# Altium schematic sheet [2]STM32F334R8T6Board_Interfaces.SchDoc
size B
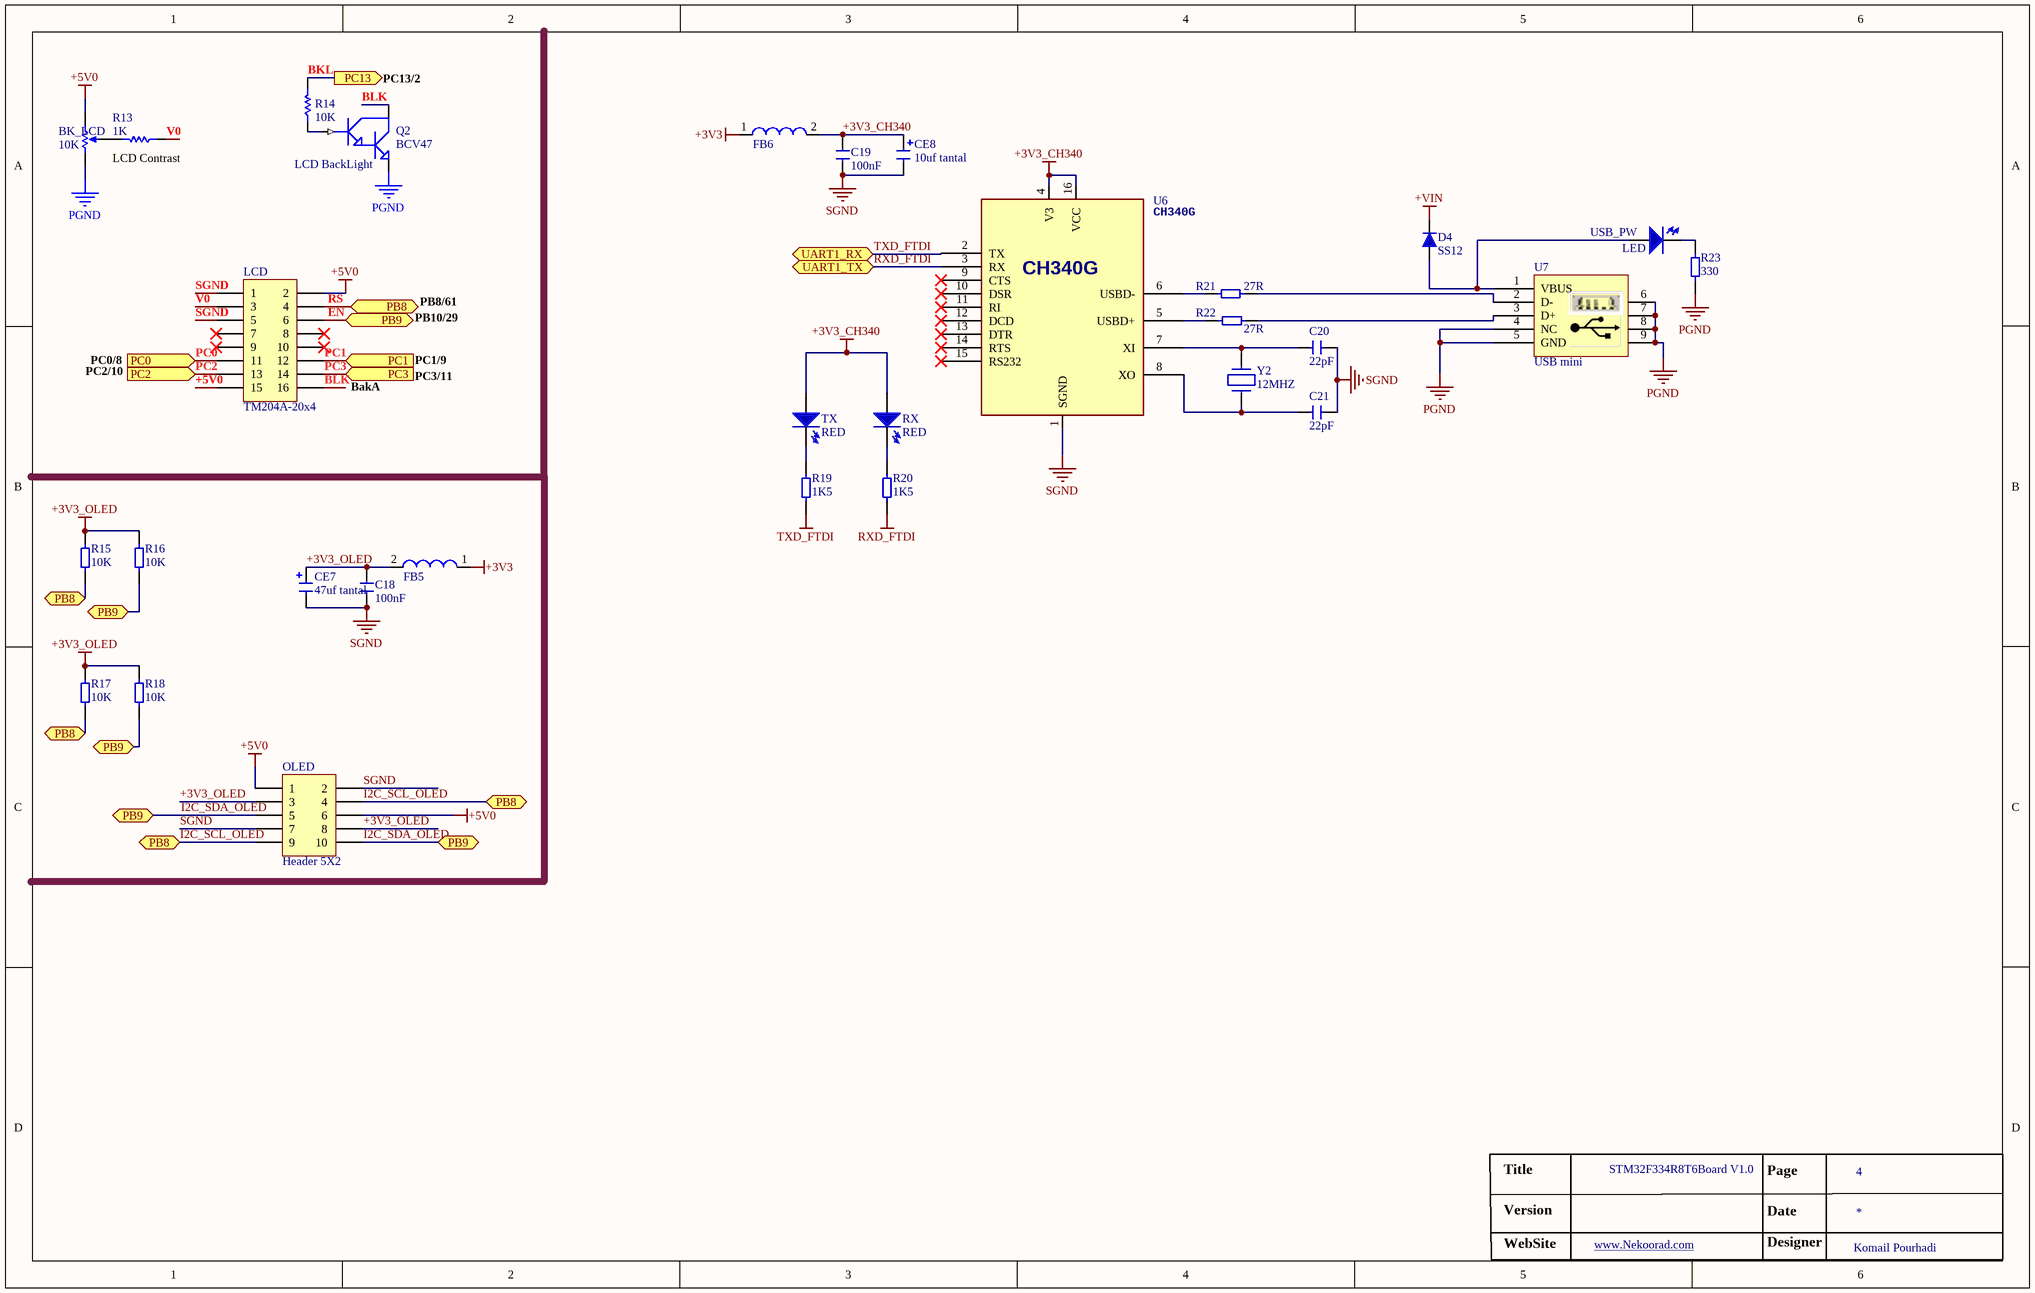
[diagram p0: [2]STM32F334R8T6Board_Interfaces.SchDoc]

## Parts
BK_LCD  value 10K  [JFP]  (hidden comment: RPot)
C18  Comment  [SMD_CAP_1206]  (value not drawn)
C19  Comment  [SMD_CAP_1206]  (value not drawn)
C20  Comment  [SMD_CAP_1206]  (value not drawn)
C21  Comment  [SMD_CAP_1206]  (value not drawn)
CE7  47uf tantal  [CAP-E-3]
CE8  10uf tantal  [cap-e-2]
D4  SS12  [Diode SMA-M]
FB5  Comment  [r4p]  (value not drawn)
FB6  Comment  [r4p]  (value not drawn)
LCD  TM204A-20x4  [IDC16_BOX]
OLED  Header 5X2  [IDC10-BOX]
Q2  BCV47  [SOT23_BEC_M]
R13  1K  [RES_1206]
R14  10K  [RES_1206]
R15  RESISTOR  [RES_1206]  (value not drawn)
R16  RESISTOR  [RES_1206]  (value not drawn)
R17  RESISTOR  [RES_1206]  (value not drawn)
R18  RESISTOR  [RES_1206]  (value not drawn)
R19  RESISTOR  [RES_1206]  (value not drawn)
R20  RESISTOR  [RES_1206]  (value not drawn)
R21  Comment  [RES_1206]  (value not drawn)
R22  Comment  [RES_1206]  (value not drawn)
R23  Comment  [RES_1206]  (value not drawn)
RX  RED  [LED SMD 1206]
TX  RED  [LED SMD 1206]
U6  CH340G  [Header smd 2*8]
U7  USB mini  [SMD_Mini USB Connector]
USB_PW  LED  [LED SMD 1206]
Y2  12MHZ  [Crystal SMD]

## Ports
PB8 (bidir), PB9 (bidir), PC0 (in), PC1 (in), PC2 (in), PC3 (in), PC13 (out), UART1_RX (bidir), UART1_TX (bidir)

## Nets
+3V3: FB5.1 FB6.1
+3V3_CH340: C19.2 CE8.1 FB6.2 RX.1(A) TX.1(A) U6.4(V3) U6.16(VCC)
+3V3_OLED: C18.2 CE7.1 FB5.2 OLED.3 OLED.8 R15.1 R16.1 R17.1 R18.1
+5V0: BK_LCD.3(BOT) LCD.2 LCD.15 OLED.1 OLED.6
+VIN: D4.2(K)
PGND: BK_LCD.1(TOP) Q2.2(E) R23.2 U7.4(NC) U7.5(GND) U7.6 U7.7 U7.8 U7.9
RXD_FTDI: R20.1 U6.3(RX) ; port UART1_TX
SGND: C18.1 C19.1 C20.1 C21.2 CE7.2 CE8.2 LCD.1 LCD.5 OLED.2 OLED.7 U6.1(SGND)
TXD_FTDI: R19.1 U6.2(TX) ; port UART1_RX
BKL: R14.2 ; port PC13
BLK: LCD.16 Q2.3(C)
EN: LCD.6 OLED.5 OLED.10 R16.2 R18.2 ; port PB9  [also labelled I2C_SDA_OLED]
I2C_SCL_OLED: LCD.4 OLED.4 OLED.9 R15.2 R17.2 ; port PB8  [also labelled RS]
PC0: LCD.11 ; port PC0
PC1: LCD.12 ; port PC1
PC2: LCD.13 ; port PC2
PC3: LCD.14 ; port PC3
V0: LCD.3 R13.1
NetBK_LCD_2: BK_LCD.2(TAP) R13.2
NetC20_2: C20.2 U6.7(XI) Y2.2
NetC21_1: C21.1 U6.8(XO) Y2.1
NetD4_1: D4.1(A) U7.1(VBUS) USB_PW.1(A)
NetQ2_1: Q2.1(B) R14.1
NetR19_2: R19.2 TX.2(K)
NetR20_2: R20.2 RX.2(K)
NetR21_1: R21.1 U6.6(USBD-)
NetR21_2: R21.2 U7.2(D-)
NetR22_1: R22.1 U6.5(USBD+)
NetR22_2: R22.2 U7.3(D+)
NetR23_1: R23.1 USB_PW.2(K)

Not connected (* = marked no-connect by the designer): LCD 7* 8* 9* 10*; U6 9(CTS)* 10(DSR)* 11(RI)* 12(DCD)* 13(DTR)* 14(RTS)* 15(RS232)*

## Notes on the sheet
- (near Q2) PC13/2
- LCD Contrast
- (near Q2) LCD BackLight
- PC0/8
- PC1/9
- PB10/29
- PB8/61
- PC2/10
- (near LCD) BakA
- PC3/11
- Title
- STM32F334R8T6Board V1.0
- Page
- 4
- Version
- WebSite
- www.Nekoorad.com <http://www.Nekoorad.com>
- Date
- Designer
- Komail Pourhadi
- (in symbol Capacitor SMD) 22pF; 100nF
- (in symbol Resistor SMD) 1K5; 27R; 10K; 330

## Library data of the parts
BK_LCD = RPot: Potentiometer; Sim Note: Enter the Resistance value and the set point into parameter fields.; Set Position: 0.5; Published: 8-Jun-2000; LatestRevisionDate: 17-Jul-2002; LatestRevisionNote: Re-released for DXP Platform.; PackageReference: VR5; Publisher: Altium Limited; PackageDescription: Variable Resistor, Thru-Hole; 3 Leads
C18-C21 = Capacitor SMD
CE7 CE8 = Capacitor Tantalium
D4 = 1N4001
FB5 FB6 = Ferrit Bead
LCD = Header 8X2: Header, 8-Pin, Dual row; LatestRevisionDate: 17-Jul-2002; LatestRevisionNote: Re-released for DXP Platform.; Publisher: Altium Limited
OLED = Header 5X2: Header, 5-Pin, Dual row; LatestRevisionDate: 17-Jul-2002; LatestRevisionNote: Re-released for DXP Platform.; Publisher: Altium Limited
Q2 = NPN DAR
R13 R14 = Resistor: Tolerance: 5%; Power: 1/8 W
  R13: Value: 1K
  R14: Value: 10K
R15-R23 = Resistor SMD
RX TX USB_PW = LED SMD
U6 = CH340G_SOP16: USB-UART; MANF_P#: CH340G; VALUE: CH340G
U7 = USB mini: mini USB Connector
Y2 = Xtal